# EAGLE design wordclock-2-charlieplex (EAGLE 5.12)
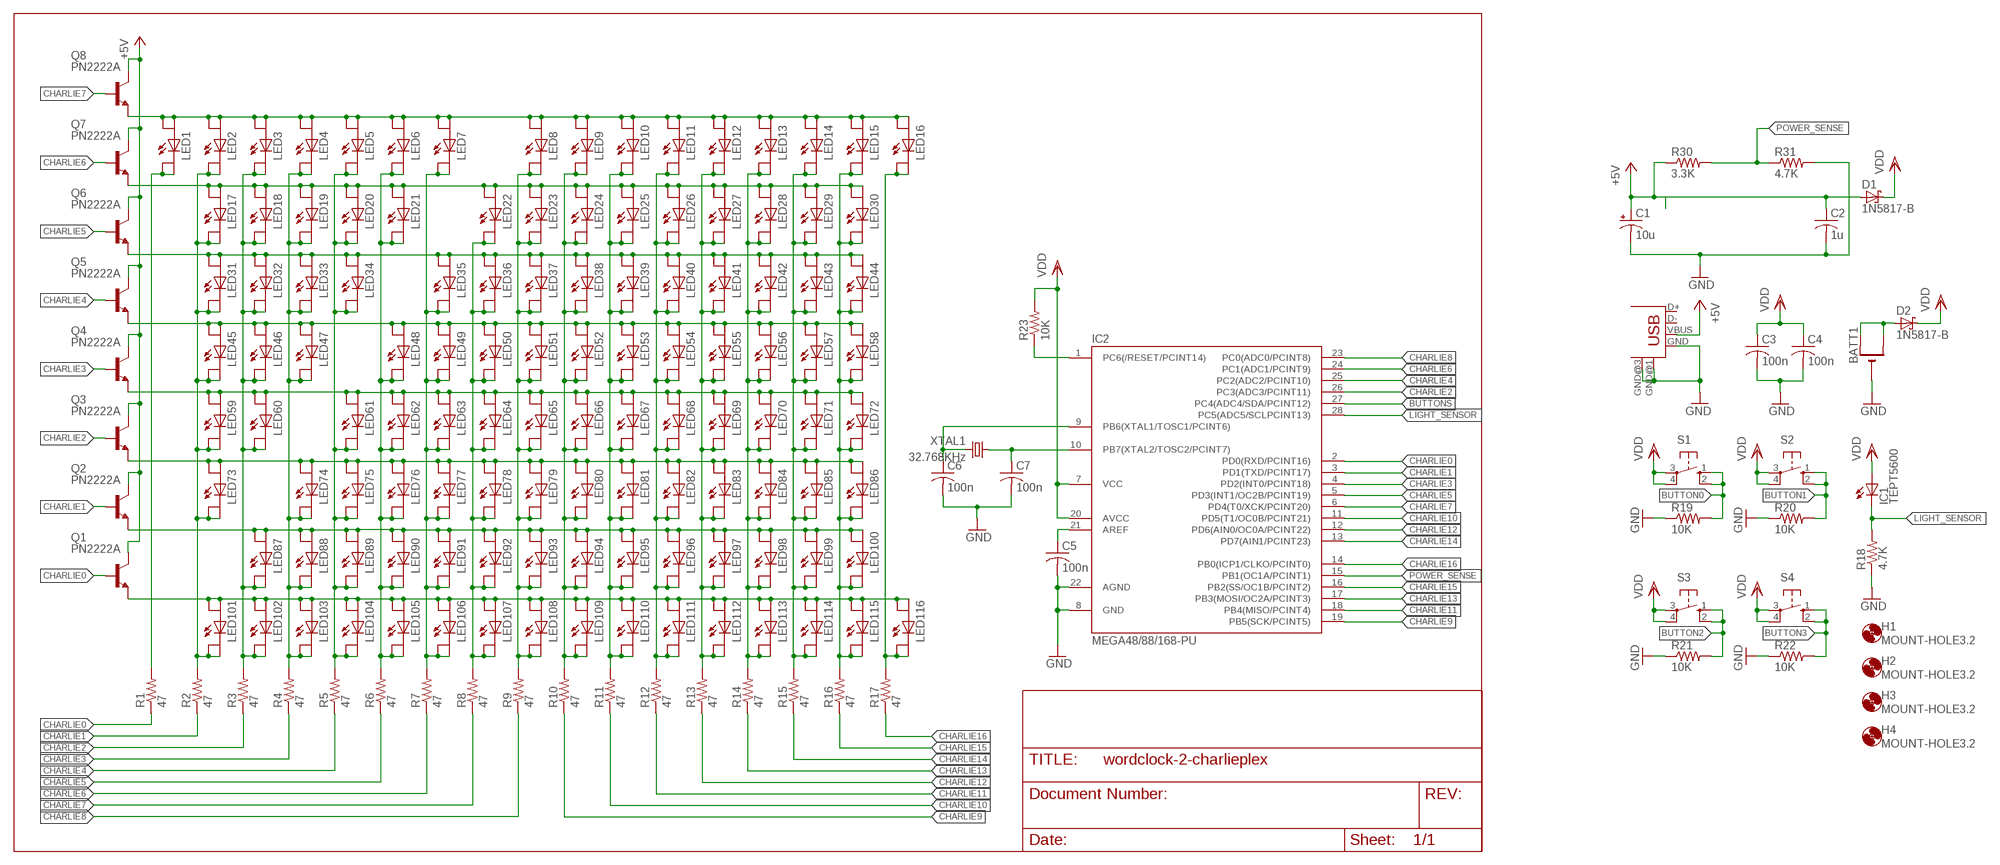
[diagram p0: schematic, sheet 1]

## Parts
BATT1  CR1220THM  [CR1220-THM]
C1  10u  CPOL-USE2-5  [E2-5]
C2  1u  C-US050-025X075  [C050-025X075]
C3  100n  C-US050-025X075  [C050-025X075]
C4  100n  C-US050-025X075  [C050-025X075]
C5  100n  C-US050-025X075  [C050-025X075]
C6  100n  C-US050-025X075  [C050-025X075]
C7  100n  C-US050-025X075  [C050-025X075]
D1  1N5817-B  [DO41-7.6]
D2  1N5817-B  [DO41-7.6]
H1  MOUNT-HOLE3.2  [3,2]
H2  MOUNT-HOLE3.2  [3,2]
H3  MOUNT-HOLE3.2  [3,2]
H4  MOUNT-HOLE3.2  [3,2]
IC1  TEPT5600  LED5MM  [LED5MM]
IC2  MEGA48/88/168-PU  [DIL28-3]
LED1  LED-2PLCC2-T1.75  [PLCC2-T1.75]
LED2  LED-2PLCC2-T1.75  [PLCC2-T1.75]
LED3  LED-2PLCC2-T1.75  [PLCC2-T1.75]
LED4  LED-2PLCC2-T1.75  [PLCC2-T1.75]
LED5  LED-2PLCC2-T1.75  [PLCC2-T1.75]
LED6  LED-2PLCC2-T1.75  [PLCC2-T1.75]
LED7  LED-2PLCC2-T1.75  [PLCC2-T1.75]
LED8  LED-2PLCC2-T1.75  [PLCC2-T1.75]
LED9  LED-2PLCC2-T1.75  [PLCC2-T1.75]
LED10  LED-2PLCC2-T1.75  [PLCC2-T1.75]
LED11  LED-2PLCC2-T1.75  [PLCC2-T1.75]
LED12  LED-2PLCC2-T1.75  [PLCC2-T1.75]
LED13  LED-2PLCC2-T1.75  [PLCC2-T1.75]
LED14  LED-2PLCC2-T1.75  [PLCC2-T1.75]
LED15  LED-2PLCC2-T1.75  [PLCC2-T1.75]
LED16  LED-2PLCC2-T1.75  [PLCC2-T1.75]
LED17  LED-2PLCC2-T1.75  [PLCC2-T1.75]
LED18  LED-2PLCC2-T1.75  [PLCC2-T1.75]
LED19  LED-2PLCC2-T1.75  [PLCC2-T1.75]
LED20  LED-2PLCC2-T1.75  [PLCC2-T1.75]
LED21  LED-2PLCC2-T1.75  [PLCC2-T1.75]
LED22  LED-2PLCC2-T1.75  [PLCC2-T1.75]
LED23  LED-2PLCC2-T1.75  [PLCC2-T1.75]
LED24  LED-2PLCC2-T1.75  [PLCC2-T1.75]
LED25  LED-2PLCC2-T1.75  [PLCC2-T1.75]
LED26  LED-2PLCC2-T1.75  [PLCC2-T1.75]
LED27  LED-2PLCC2-T1.75  [PLCC2-T1.75]
LED28  LED-2PLCC2-T1.75  [PLCC2-T1.75]
LED29  LED-2PLCC2-T1.75  [PLCC2-T1.75]
LED30  LED-2PLCC2-T1.75  [PLCC2-T1.75]
LED31  LED-2PLCC2-T1.75  [PLCC2-T1.75]
LED32  LED-2PLCC2-T1.75  [PLCC2-T1.75]
LED33  LED-2PLCC2-T1.75  [PLCC2-T1.75]
LED34  LED-2PLCC2-T1.75  [PLCC2-T1.75]
LED35  LED-2PLCC2-T1.75  [PLCC2-T1.75]
LED36  LED-2PLCC2-T1.75  [PLCC2-T1.75]
LED37  LED-2PLCC2-T1.75  [PLCC2-T1.75]
LED38  LED-2PLCC2-T1.75  [PLCC2-T1.75]
LED39  LED-2PLCC2-T1.75  [PLCC2-T1.75]
LED40  LED-2PLCC2-T1.75  [PLCC2-T1.75]
LED41  LED-2PLCC2-T1.75  [PLCC2-T1.75]
LED42  LED-2PLCC2-T1.75  [PLCC2-T1.75]
LED43  LED-2PLCC2-T1.75  [PLCC2-T1.75]
LED44  LED-2PLCC2-T1.75  [PLCC2-T1.75]
LED45  LED-2PLCC2-T1.75  [PLCC2-T1.75]
LED46  LED-2PLCC2-T1.75  [PLCC2-T1.75]
LED47  LED-2PLCC2-T1.75  [PLCC2-T1.75]
LED48  LED-2PLCC2-T1.75  [PLCC2-T1.75]
LED49  LED-2PLCC2-T1.75  [PLCC2-T1.75]
LED50  LED-2PLCC2-T1.75  [PLCC2-T1.75]
LED51  LED-2PLCC2-T1.75  [PLCC2-T1.75]
LED52  LED-2PLCC2-T1.75  [PLCC2-T1.75]
LED53  LED-2PLCC2-T1.75  [PLCC2-T1.75]
LED54  LED-2PLCC2-T1.75  [PLCC2-T1.75]
LED55  LED-2PLCC2-T1.75  [PLCC2-T1.75]
LED56  LED-2PLCC2-T1.75  [PLCC2-T1.75]
LED57  LED-2PLCC2-T1.75  [PLCC2-T1.75]
LED58  LED-2PLCC2-T1.75  [PLCC2-T1.75]
LED59  LED-2PLCC2-T1.75  [PLCC2-T1.75]
LED60  LED-2PLCC2-T1.75  [PLCC2-T1.75]
LED61  LED-2PLCC2-T1.75  [PLCC2-T1.75]
LED62  LED-2PLCC2-T1.75  [PLCC2-T1.75]
LED63  LED-2PLCC2-T1.75  [PLCC2-T1.75]
LED64  LED-2PLCC2-T1.75  [PLCC2-T1.75]
LED65  LED-2PLCC2-T1.75  [PLCC2-T1.75]
LED66  LED-2PLCC2-T1.75  [PLCC2-T1.75]
LED67  LED-2PLCC2-T1.75  [PLCC2-T1.75]
LED68  LED-2PLCC2-T1.75  [PLCC2-T1.75]
LED69  LED-2PLCC2-T1.75  [PLCC2-T1.75]
LED70  LED-2PLCC2-T1.75  [PLCC2-T1.75]
LED71  LED-2PLCC2-T1.75  [PLCC2-T1.75]
LED72  LED-2PLCC2-T1.75  [PLCC2-T1.75]
LED73  LED-2PLCC2-T1.75  [PLCC2-T1.75]
LED74  LED-2PLCC2-T1.75  [PLCC2-T1.75]
LED75  LED-2PLCC2-T1.75  [PLCC2-T1.75]
LED76  LED-2PLCC2-T1.75  [PLCC2-T1.75]
LED77  LED-2PLCC2-T1.75  [PLCC2-T1.75]
LED78  LED-2PLCC2-T1.75  [PLCC2-T1.75]
LED79  LED-2PLCC2-T1.75  [PLCC2-T1.75]
LED80  LED-2PLCC2-T1.75  [PLCC2-T1.75]
LED81  LED-2PLCC2-T1.75  [PLCC2-T1.75]
LED82  LED-2PLCC2-T1.75  [PLCC2-T1.75]
LED83  LED-2PLCC2-T1.75  [PLCC2-T1.75]
LED84  LED-2PLCC2-T1.75  [PLCC2-T1.75]
LED85  LED-2PLCC2-T1.75  [PLCC2-T1.75]
LED86  LED-2PLCC2-T1.75  [PLCC2-T1.75]
LED87  LED-2PLCC2-T1.75  [PLCC2-T1.75]
LED88  LED-2PLCC2-T1.75  [PLCC2-T1.75]
LED89  LED-2PLCC2-T1.75  [PLCC2-T1.75]
LED90  LED-2PLCC2-T1.75  [PLCC2-T1.75]
LED91  LED-2PLCC2-T1.75  [PLCC2-T1.75]
LED92  LED-2PLCC2-T1.75  [PLCC2-T1.75]
LED93  LED-2PLCC2-T1.75  [PLCC2-T1.75]
LED94  LED-2PLCC2-T1.75  [PLCC2-T1.75]
LED95  LED-2PLCC2-T1.75  [PLCC2-T1.75]
LED96  LED-2PLCC2-T1.75  [PLCC2-T1.75]
LED97  LED-2PLCC2-T1.75  [PLCC2-T1.75]
LED98  LED-2PLCC2-T1.75  [PLCC2-T1.75]
LED99  LED-2PLCC2-T1.75  [PLCC2-T1.75]
LED100  LED-2PLCC2-T1.75  [PLCC2-T1.75]
LED101  LED-2PLCC2-T1.75  [PLCC2-T1.75]
LED102  LED-2PLCC2-T1.75  [PLCC2-T1.75]
LED103  LED-2PLCC2-T1.75  [PLCC2-T1.75]
LED104  LED-2PLCC2-T1.75  [PLCC2-T1.75]
LED105  LED-2PLCC2-T1.75  [PLCC2-T1.75]
LED106  LED-2PLCC2-T1.75  [PLCC2-T1.75]
LED107  LED-2PLCC2-T1.75  [PLCC2-T1.75]
LED108  LED-2PLCC2-T1.75  [PLCC2-T1.75]
LED109  LED-2PLCC2-T1.75  [PLCC2-T1.75]
LED110  LED-2PLCC2-T1.75  [PLCC2-T1.75]
LED111  LED-2PLCC2-T1.75  [PLCC2-T1.75]
LED112  LED-2PLCC2-T1.75  [PLCC2-T1.75]
LED113  LED-2PLCC2-T1.75  [PLCC2-T1.75]
LED114  LED-2PLCC2-T1.75  [PLCC2-T1.75]
LED115  LED-2PLCC2-T1.75  [PLCC2-T1.75]
LED116  LED-2PLCC2-T1.75  [PLCC2-T1.75]
Q1  PN2222A  2N3904  [TO92]
Q2  PN2222A  2N3904  [TO92]
Q3  PN2222A  2N3904  [TO92]
Q4  PN2222A  2N3904  [TO92]
Q5  PN2222A  2N3904  [TO92]
Q6  PN2222A  2N3904  [TO92]
Q7  PN2222A  2N3904  [TO92]
Q8  PN2222A  2N3904  [TO92]
R1  47  R-US_0207/10  [0207/10]
R2  47  R-US_0207/10  [0207/10]
R3  47  R-US_0207/10  [0207/10]
R4  47  R-US_0207/10  [0207/10]
R5  47  R-US_0207/10  [0207/10]
R6  47  R-US_0207/10  [0207/10]
R7  47  R-US_0207/10  [0207/10]
R8  47  R-US_0207/10  [0207/10]
R9  47  R-US_0207/10  [0207/10]
R10  47  R-US_0207/10  [0207/10]
R11  47  R-US_0207/10  [0207/10]
R12  47  R-US_0207/10  [0207/10]
R13  47  R-US_0207/10  [0207/10]
R14  47  R-US_0207/10  [0207/10]
R15  47  R-US_0207/10  [0207/10]
R16  47  R-US_0207/10  [0207/10]
R17  47  R-US_0207/10  [0207/10]
R18  4.7K  R-US_0207/10  [0207/10]
R19  10K  R-US_0207/10  [0207/10]
R20  10K  R-US_0207/10  [0207/10]
R21  10K  R-US_0207/10  [0207/10]
R22  10K  R-US_0207/10  [0207/10]
R23  10K  R-US_0207/10  [0207/10]
R30  3.3K  R-US_0207/10  [0207/10]
R31  4.7K  R-US_0207/10  [0207/10]
S1  10-XX  [B3F-10XX]
S2  10-XX  [B3F-10XX]
S3  10-XX  [B3F-10XX]
S4  10-XX  [B3F-10XX]
USB1  USB-RAYMOND-SHORT  [USB-MB-RAYMOND-SHORT]
XTAL1  32.768KHz  CRYSTALTC38H  [TC38H]

## Nets
+5V: C1.+ Q1.1(C) Q2.1(C) Q3.1(C) Q4.1(C) Q5.1(C) Q6.1(C) Q7.1(C) Q8.1(C) R30.1 USB1.VBUS
BUTTON0: R19.2 S1.1(S) S1.2(S1)
BUTTON1: R20.2 S2.1(S) S2.2(S1)
BUTTON2: R21.2 S3.1(S) S3.2(S1)
BUTTON3: R22.2 S4.1(S) S4.2(S1)
BUTTONS: IC2.27(PC4(ADC4/SDA/PCINT12))
CHARLIE0: IC2.2(PD0(RXD/PCINT16)) Q1.2(B) R1.1
CHARLIE1: IC2.3(PD1(TXD/PCINT17)) Q2.2(B) R2.1
CHARLIE2: IC2.26(PC3(ADC3/PCINT11)) Q3.2(B) R3.1
CHARLIE3: IC2.4(PD2(INT0/PCINT18)) Q4.2(B) R4.1
CHARLIE4: IC2.25(PC2(ADC2/PCINT10)) Q5.2(B) R5.1
CHARLIE5: IC2.5(PD3(INT1/OC2B/PCINT19)) Q6.2(B) R6.1
CHARLIE6: IC2.24(PC1(ADC1/PCINT9)) Q7.2(B) R7.1
CHARLIE7: IC2.6(PD4(T0/XCK/PCINT20)) Q8.2(B) R8.1
CHARLIE8: IC2.23(PC0(ADC0/PCINT8)) R9.1
CHARLIE9: IC2.19(PB5(SCK/PCINT5)) R10.1
CHARLIE10: IC2.11(PD5(T1/OC0B/PCINT21)) R11.1
CHARLIE11: IC2.18(PB4(MISO/PCINT4)) R12.1
CHARLIE12: IC2.12(PD6(AIN0/OC0A/PCINT22)) R13.1
CHARLIE13: IC2.17(PB3(MOSI/OC2A/PCINT3)) R14.1
CHARLIE14: IC2.13(PD7(AIN1/PCINT23)) R15.1
CHARLIE15: IC2.16(PB2(SS/OC1B/PCINT2)) R16.1
CHARLIE16: IC2.14(PB0(ICP1/CLKO/PCINT0)) R17.1
COL0: LED1.K1(K) LED1.K2(K1) R1.2
COL1: LED2.K1(K) LED2.K2(K1) LED17.K1(K) LED17.K2(K1) LED31.K1(K) LED31.K2(K1) LED45.K1(K) LED45.K2(K1) LED59.K1(K) LED59.K2(K1) LED73.K1(K) LED73.K2(K1) LED101.K1(K) LED101.K2(K1) R2.2
COL2: LED3.K1(K) LED3.K2(K1) LED18.K1(K) LED18.K2(K1) LED32.K1(K) LED32.K2(K1) LED46.K1(K) LED46.K2(K1) LED60.K1(K) LED60.K2(K1) LED87.K1(K) LED87.K2(K1) LED102.K1(K) LED102.K2(K1) R3.2
COL3: LED4.K1(K) LED4.K2(K1) LED19.K1(K) LED19.K2(K1) LED33.K1(K) LED33.K2(K1) LED47.K1(K) LED47.K2(K1) LED74.K1(K) LED74.K2(K1) LED88.K1(K) LED88.K2(K1) LED103.K1(K) LED103.K2(K1) R4.2
COL4: LED5.K1(K) LED5.K2(K1) LED20.K1(K) LED20.K2(K1) LED34.K1(K) LED34.K2(K1) LED61.K1(K) LED61.K2(K1) LED75.K1(K) LED75.K2(K1) LED89.K1(K) LED89.K2(K1) LED104.K1(K) LED104.K2(K1) R5.2
COL5: LED6.K1(K) LED6.K2(K1) LED21.K1(K) LED21.K2(K1) LED48.K1(K) LED48.K2(K1) LED62.K1(K) LED62.K2(K1) LED76.K1(K) LED76.K2(K1) LED90.K1(K) LED90.K2(K1) LED105.K1(K) LED105.K2(K1) R6.2
COL6: LED7.K1(K) LED7.K2(K1) LED35.K1(K) LED35.K2(K1) LED49.K1(K) LED49.K2(K1) LED63.K1(K) LED63.K2(K1) LED77.K1(K) LED77.K2(K1) LED91.K1(K) LED91.K2(K1) LED106.K1(K) LED106.K2(K1) R7.2
COL7: LED22.K1(K) LED22.K2(K1) LED36.K1(K) LED36.K2(K1) LED50.K1(K) LED50.K2(K1) LED64.K1(K) LED64.K2(K1) LED78.K1(K) LED78.K2(K1) LED92.K1(K) LED92.K2(K1) LED107.K1(K) LED107.K2(K1) R8.2
COL8: LED8.K1(K) LED8.K2(K1) LED23.K1(K) LED23.K2(K1) LED37.K1(K) LED37.K2(K1) LED51.K1(K) LED51.K2(K1) LED65.K1(K) LED65.K2(K1) LED79.K1(K) LED79.K2(K1) LED93.K1(K) LED93.K2(K1) LED108.K1(K) LED108.K2(K1) R9.2
COL9: LED9.K1(K) LED9.K2(K1) LED24.K1(K) LED24.K2(K1) LED38.K1(K) LED38.K2(K1) LED52.K1(K) LED52.K2(K1) LED66.K1(K) LED66.K2(K1) LED80.K1(K) LED80.K2(K1) LED94.K1(K) LED94.K2(K1) LED109.K1(K) LED109.K2(K1) R10.2
COL10: LED10.K1(K) LED10.K2(K1) LED25.K1(K) LED25.K2(K1) LED39.K1(K) LED39.K2(K1) LED53.K1(K) LED53.K2(K1) LED67.K1(K) LED67.K2(K1) LED81.K1(K) LED81.K2(K1) LED95.K1(K) LED95.K2(K1) LED110.K1(K) LED110.K2(K1) R11.2
COL11: LED11.K1(K) LED11.K2(K1) LED26.K1(K) LED26.K2(K1) LED40.K1(K) LED40.K2(K1) LED54.K1(K) LED54.K2(K1) LED68.K1(K) LED68.K2(K1) LED82.K1(K) LED82.K2(K1) LED96.K1(K) LED96.K2(K1) LED111.K1(K) LED111.K2(K1) R12.2
COL12: LED12.K1(K) LED12.K2(K1) LED27.K1(K) LED27.K2(K1) LED41.K1(K) LED41.K2(K1) LED55.K1(K) LED55.K2(K1) LED69.K1(K) LED69.K2(K1) LED83.K1(K) LED83.K2(K1) LED97.K1(K) LED97.K2(K1) LED112.K1(K) LED112.K2(K1) R13.2
COL13: LED13.K1(K) LED13.K2(K1) LED28.K1(K) LED28.K2(K1) LED42.K1(K) LED42.K2(K1) LED56.K1(K) LED56.K2(K1) LED70.K1(K) LED70.K2(K1) LED84.K1(K) LED84.K2(K1) LED98.K1(K) LED98.K2(K1) LED113.K1(K) LED113.K2(K1) R14.2
COL14: LED14.K1(K) LED14.K2(K1) LED29.K1(K) LED29.K2(K1) LED43.K1(K) LED43.K2(K1) LED57.K1(K) LED57.K2(K1) LED71.K1(K) LED71.K2(K1) LED85.K1(K) LED85.K2(K1) LED99.K1(K) LED99.K2(K1) LED114.K1(K) LED114.K2(K1) R15.2
COL15: LED15.K1(K) LED15.K2(K1) LED30.K1(K) LED30.K2(K1) LED44.K1(K) LED44.K2(K1) LED58.K1(K) LED58.K2(K1) LED72.K1(K) LED72.K2(K1) LED86.K1(K) LED86.K2(K1) LED100.K1(K) LED100.K2(K1) LED115.K1(K) LED115.K2(K1) R16.2
COL16: LED16.K1(K) LED16.K2(K1) LED116.K1(K) LED116.K2(K1) R17.2
GND: BATT1.- C1.- C2.2 C3.2 C4.2 C5.2 C6.2 C7.2 IC2.8(GND) IC2.22(AGND) R18.1 R19.1 R20.1 R21.1 R22.1 R31.2 USB1.GND USB1.GND@1(GND) USB1.GND@3(GND)
LIGHT_SENSOR: IC1.K(C) IC2.28(PC5(ADC5/SCLPCINT13)) R18.2
N$1: C5.1 IC2.21(AREF)
N$2: C6.1 IC2.9(PB6(XTAL1/TOSC1/PCINT6)) XTAL1.2
N$3: BATT1.+1(+) BATT1.+2(+1) D2.A
N$4: IC2.1(PC6(/RESET/PCINT14)) R23.1
N$5: C7.1 IC2.10(PB7(XTAL2/TOSC2/PCINT7)) XTAL1.1
N$9: C2.1 D1.A
POWER_SENSE: IC2.15(PB1(OC1A/PCINT1)) R30.2 R31.1
ROW0: LED101.A1(A) LED101.A2(A1) LED102.A1(A) LED102.A2(A1) LED103.A1(A) LED103.A2(A1) LED104.A1(A) LED104.A2(A1) LED105.A1(A) LED105.A2(A1) LED106.A1(A) LED106.A2(A1) LED107.A1(A) LED107.A2(A1) LED108.A1(A) LED108.A2(A1) LED109.A1(A) LED109.A2(A1) LED110.A1(A) LED110.A2(A1) LED111.A1(A) LED111.A2(A1) LED112.A1(A) LED112.A2(A1) LED113.A1(A) LED113.A2(A1) LED114.A1(A) LED114.A2(A1) LED115.A1(A) LED115.A2(A1) LED116.A1(A) LED116.A2(A1) Q1.3(E)
ROW1: LED87.A1(A) LED87.A2(A1) LED88.A1(A) LED88.A2(A1) LED89.A1(A) LED89.A2(A1) LED90.A1(A) LED90.A2(A1) LED91.A1(A) LED91.A2(A1) LED92.A1(A) LED92.A2(A1) LED93.A1(A) LED93.A2(A1) LED94.A1(A) LED94.A2(A1) LED95.A1(A) LED95.A2(A1) LED96.A1(A) LED96.A2(A1) LED97.A1(A) LED97.A2(A1) LED98.A1(A) LED98.A2(A1) LED99.A1(A) LED99.A2(A1) LED100.A1(A) LED100.A2(A1) Q2.3(E)
ROW2: LED73.A1(A) LED73.A2(A1) LED74.A1(A) LED74.A2(A1) LED75.A1(A) LED75.A2(A1) LED76.A1(A) LED76.A2(A1) LED77.A1(A) LED77.A2(A1) LED78.A1(A) LED78.A2(A1) LED79.A1(A) LED79.A2(A1) LED80.A1(A) LED80.A2(A1) LED81.A1(A) LED81.A2(A1) LED82.A1(A) LED82.A2(A1) LED83.A1(A) LED83.A2(A1) LED84.A1(A) LED84.A2(A1) LED85.A1(A) LED85.A2(A1) LED86.A1(A) LED86.A2(A1) Q3.3(E)
ROW3: LED59.A1(A) LED59.A2(A1) LED60.A1(A) LED60.A2(A1) LED61.A1(A) LED61.A2(A1) LED62.A1(A) LED62.A2(A1) LED63.A1(A) LED63.A2(A1) LED64.A1(A) LED64.A2(A1) LED65.A1(A) LED65.A2(A1) LED66.A1(A) LED66.A2(A1) LED67.A1(A) LED67.A2(A1) LED68.A1(A) LED68.A2(A1) LED69.A1(A) LED69.A2(A1) LED70.A1(A) LED70.A2(A1) LED71.A1(A) LED71.A2(A1) LED72.A1(A) LED72.A2(A1) Q4.3(E)
ROW4: LED45.A1(A) LED45.A2(A1) LED46.A1(A) LED46.A2(A1) LED47.A1(A) LED47.A2(A1) LED48.A1(A) LED48.A2(A1) LED49.A1(A) LED49.A2(A1) LED50.A1(A) LED50.A2(A1) LED51.A1(A) LED51.A2(A1) LED52.A1(A) LED52.A2(A1) LED53.A1(A) LED53.A2(A1) LED54.A1(A) LED54.A2(A1) LED55.A1(A) LED55.A2(A1) LED56.A1(A) LED56.A2(A1) LED57.A1(A) LED57.A2(A1) LED58.A1(A) LED58.A2(A1) Q5.3(E)
ROW5: LED31.A1(A) LED31.A2(A1) LED32.A1(A) LED32.A2(A1) LED33.A1(A) LED33.A2(A1) LED34.A1(A) LED34.A2(A1) LED35.A1(A) LED35.A2(A1) LED36.A1(A) LED36.A2(A1) LED37.A1(A) LED37.A2(A1) LED38.A1(A) LED38.A2(A1) LED39.A1(A) LED39.A2(A1) LED40.A1(A) LED40.A2(A1) LED41.A1(A) LED41.A2(A1) LED42.A1(A) LED42.A2(A1) LED43.A1(A) LED43.A2(A1) LED44.A1(A) LED44.A2(A1) Q6.3(E)
ROW6: LED17.A1(A) LED17.A2(A1) LED18.A1(A) LED18.A2(A1) LED19.A1(A) LED19.A2(A1) LED20.A1(A) LED20.A2(A1) LED21.A1(A) LED21.A2(A1) LED22.A1(A) LED22.A2(A1) LED23.A1(A) LED23.A2(A1) LED24.A1(A) LED24.A2(A1) LED25.A1(A) LED25.A2(A1) LED26.A1(A) LED26.A2(A1) LED27.A1(A) LED27.A2(A1) LED28.A1(A) LED28.A2(A1) LED29.A1(A) LED29.A2(A1) LED30.A1(A) LED30.A2(A1) Q7.3(E)
ROW7: LED1.A1(A) LED1.A2(A1) LED2.A1(A) LED2.A2(A1) LED3.A1(A) LED3.A2(A1) LED4.A1(A) LED4.A2(A1) LED5.A1(A) LED5.A2(A1) LED6.A1(A) LED6.A2(A1) LED7.A1(A) LED7.A2(A1) LED8.A1(A) LED8.A2(A1) LED9.A1(A) LED9.A2(A1) LED10.A1(A) LED10.A2(A1) LED11.A1(A) LED11.A2(A1) LED12.A1(A) LED12.A2(A1) LED13.A1(A) LED13.A2(A1) LED14.A1(A) LED14.A2(A1) LED15.A1(A) LED15.A2(A1) LED16.A1(A) LED16.A2(A1) Q8.3(E)
VDD: C3.1 C4.1 D1.C D2.C IC1.A IC2.7(VCC) IC2.20(AVCC) R23.2 S1.3(P) S1.4(P1) S2.3(P) S2.4(P1) S3.3(P) S3.4(P1) S4.3(P) S4.4(P1)
Unconnected: USB1.D+ USB1.D-

## Library data of the parts
BATT1 = adafruit:CR1220: CR1216/CR1220/CR1225 12mm 3V lithium coin cell Great for battery packup. Both SMT and THM holders. Note the THM package has the ground pads on both sides of the PCB so that the masks are the same - this reduces the cost
C1 = rcl:CPOL-US: POLARIZED CAPACITOR, American symbol
C2-C7 = rcl:C-US: CAPACITOR, American symbol
D1 D2 = diode:1N581*: 1.0A SCHOTTKY BARRIER RECTIFIER Source: http://www.diodes.com/datasheets/ds23001.pdf
H1-H4 = holes:MOUNT-HOLE: MOUNTING HOLE with drill center marker
IC1 = led:LED: LED OSRAM: - CHIPLED LG R971, LG N971, LY N971, LG Q971, LY Q971, LO R971, LY R971 LH N974, LH R974 LS Q976, LO Q976, LY Q976 LO Q996 - Hyper CHIPLED LW Q18S LB Q993, LB Q99A, LB R99A - SideLED LS A670, LO A670, LY A670, LG A670, LP A670 LB A673, LV A673, LT A673, LW A673 LH A674 LY A675 LS A676, LA A676, LO A676, LY A676, LW A676 LS A679, LY A679, LG A679 - Hyper Micro SIDELED® LS Y876, LA Y876, LO Y876, LY Y876 LT Y87S - SmartLED LW L88C, LW L88S LB L89C, LB L89S, LG L890 LS L89K, LO L89K, LY L89K LS L896, LA L896, LO L896, LY L896 - TOPLED LS T670, LO T670, LY T670, LG T670, LP T670 LSG T670, LSP T670, LSY T670, LOP T670, LYG T670 LG T671, LOG T671, LSG T671 LB T673, LV T673, LT T673, LW T673 LH T674 LS T676, LA T676, LO T676, LY T676, LB T676, LH T676, LSB T676, LW T676 LB T67C, LV T67C, LT T67C, LS T67K, LO T67K, LY T67K, LW E67C LS E67B, LA E67B, LO E67B, LY E67B, LB E67C, LV E67C, LT E67C LW T67C LS T679, LY T679, LG T679 LS T770, LO T770, LY T770, LG T770, LP T770 LB T773, LV T773, LT T773, LW T773 LH T774 LS E675, LA E675, LY E675, LS T675 LS T776, LA T776, LO T776, LY T776, LB T776 LHGB T686 LT T68C, LB T68C - Hyper Mini TOPLED® LB M676 - Mini TOPLED Santana® LG M470 LS M47K, LO M47K, LY M47K Source: http://www.osram.convergy.de LUXEON: - LUMILED® LXK2-PW12-R00, LXK2-PW12-S00, LXK2-PW14-U00, LXK2-PW14-V00 LXK2-PM12-R00, LXK2-PM12-S00, LXK2-PM14-U00 LXK2-PE12-Q00, LXK2-PE12-R00, LXK2-PE12-S00, LXK2-PE14-T00, LXK2-PE14-U00 LXK2-PB12-K00, LXK2-PB12-L00, LXK2-PB12-M00, LXK2-PB14-N00, LXK2-PB14-P00, LXK2-PB14-Q00 LXK2-PR12-L00, LXK2-PR12-M00, LXK2-PR14-Q00, LXK2-PR14-R00 LXK2-PD12-Q00, LXK2-PD12-R00, LXK2-PD12-S00 LXK2-PH12-R00, LXK2-PH12-S00 LXK2-PL12-P00, LXK2-PL12-Q00, LXK2-PL12-R00 Source: www.luxeon.com KINGBRIGHT: KA-3528ASYC Source: www.kingbright.com
IC2 = avr-5:MEGA48/88/168-PU
LED1-LED116 = rbg-comboled:LED-2
Q1-Q8 = transistor-npn:2N3904: NPN Transistor
R1-R23 R30 R31 = rcl:R-US_: RESISTOR, American symbol
S1-S4 = switch-omron:10-XX: OMRON SWITCH; MPN: B3F-1000; OC_FARNELL: 176432; OC_NEWARK: 36M3542
USB1 = con-usb-2:USB: USB Connectors
XTAL1 = crystal:CRYSTAL: CRYSTAL; OC_FARNELL: unknown; OC_NEWARK: unknown

## Board
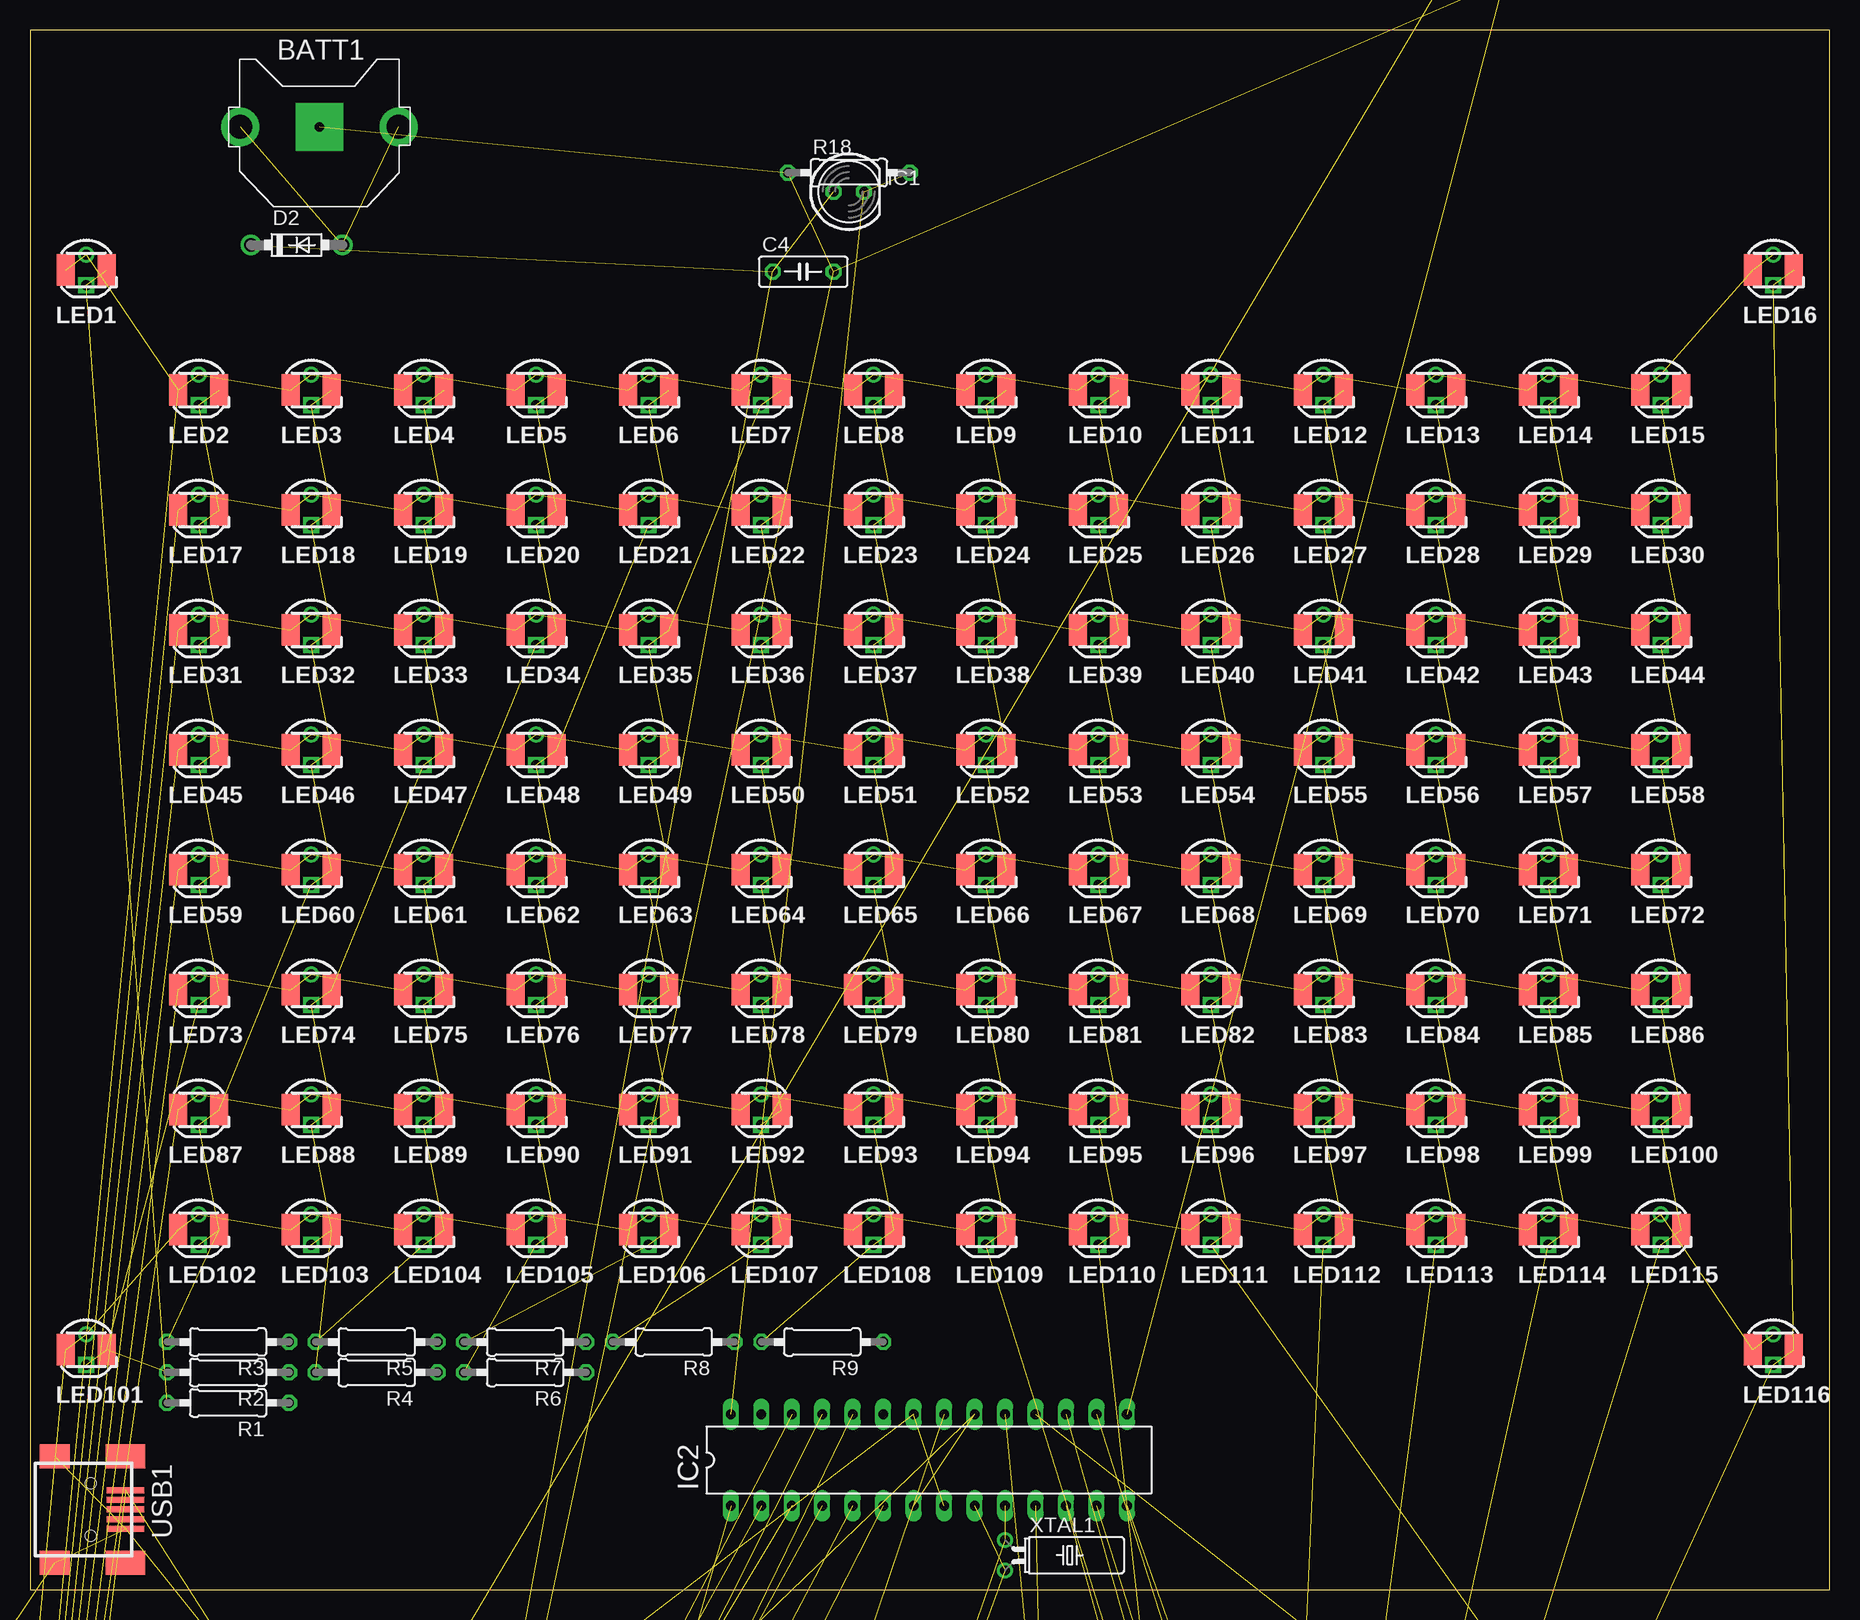
[diagram p1: board, top side]
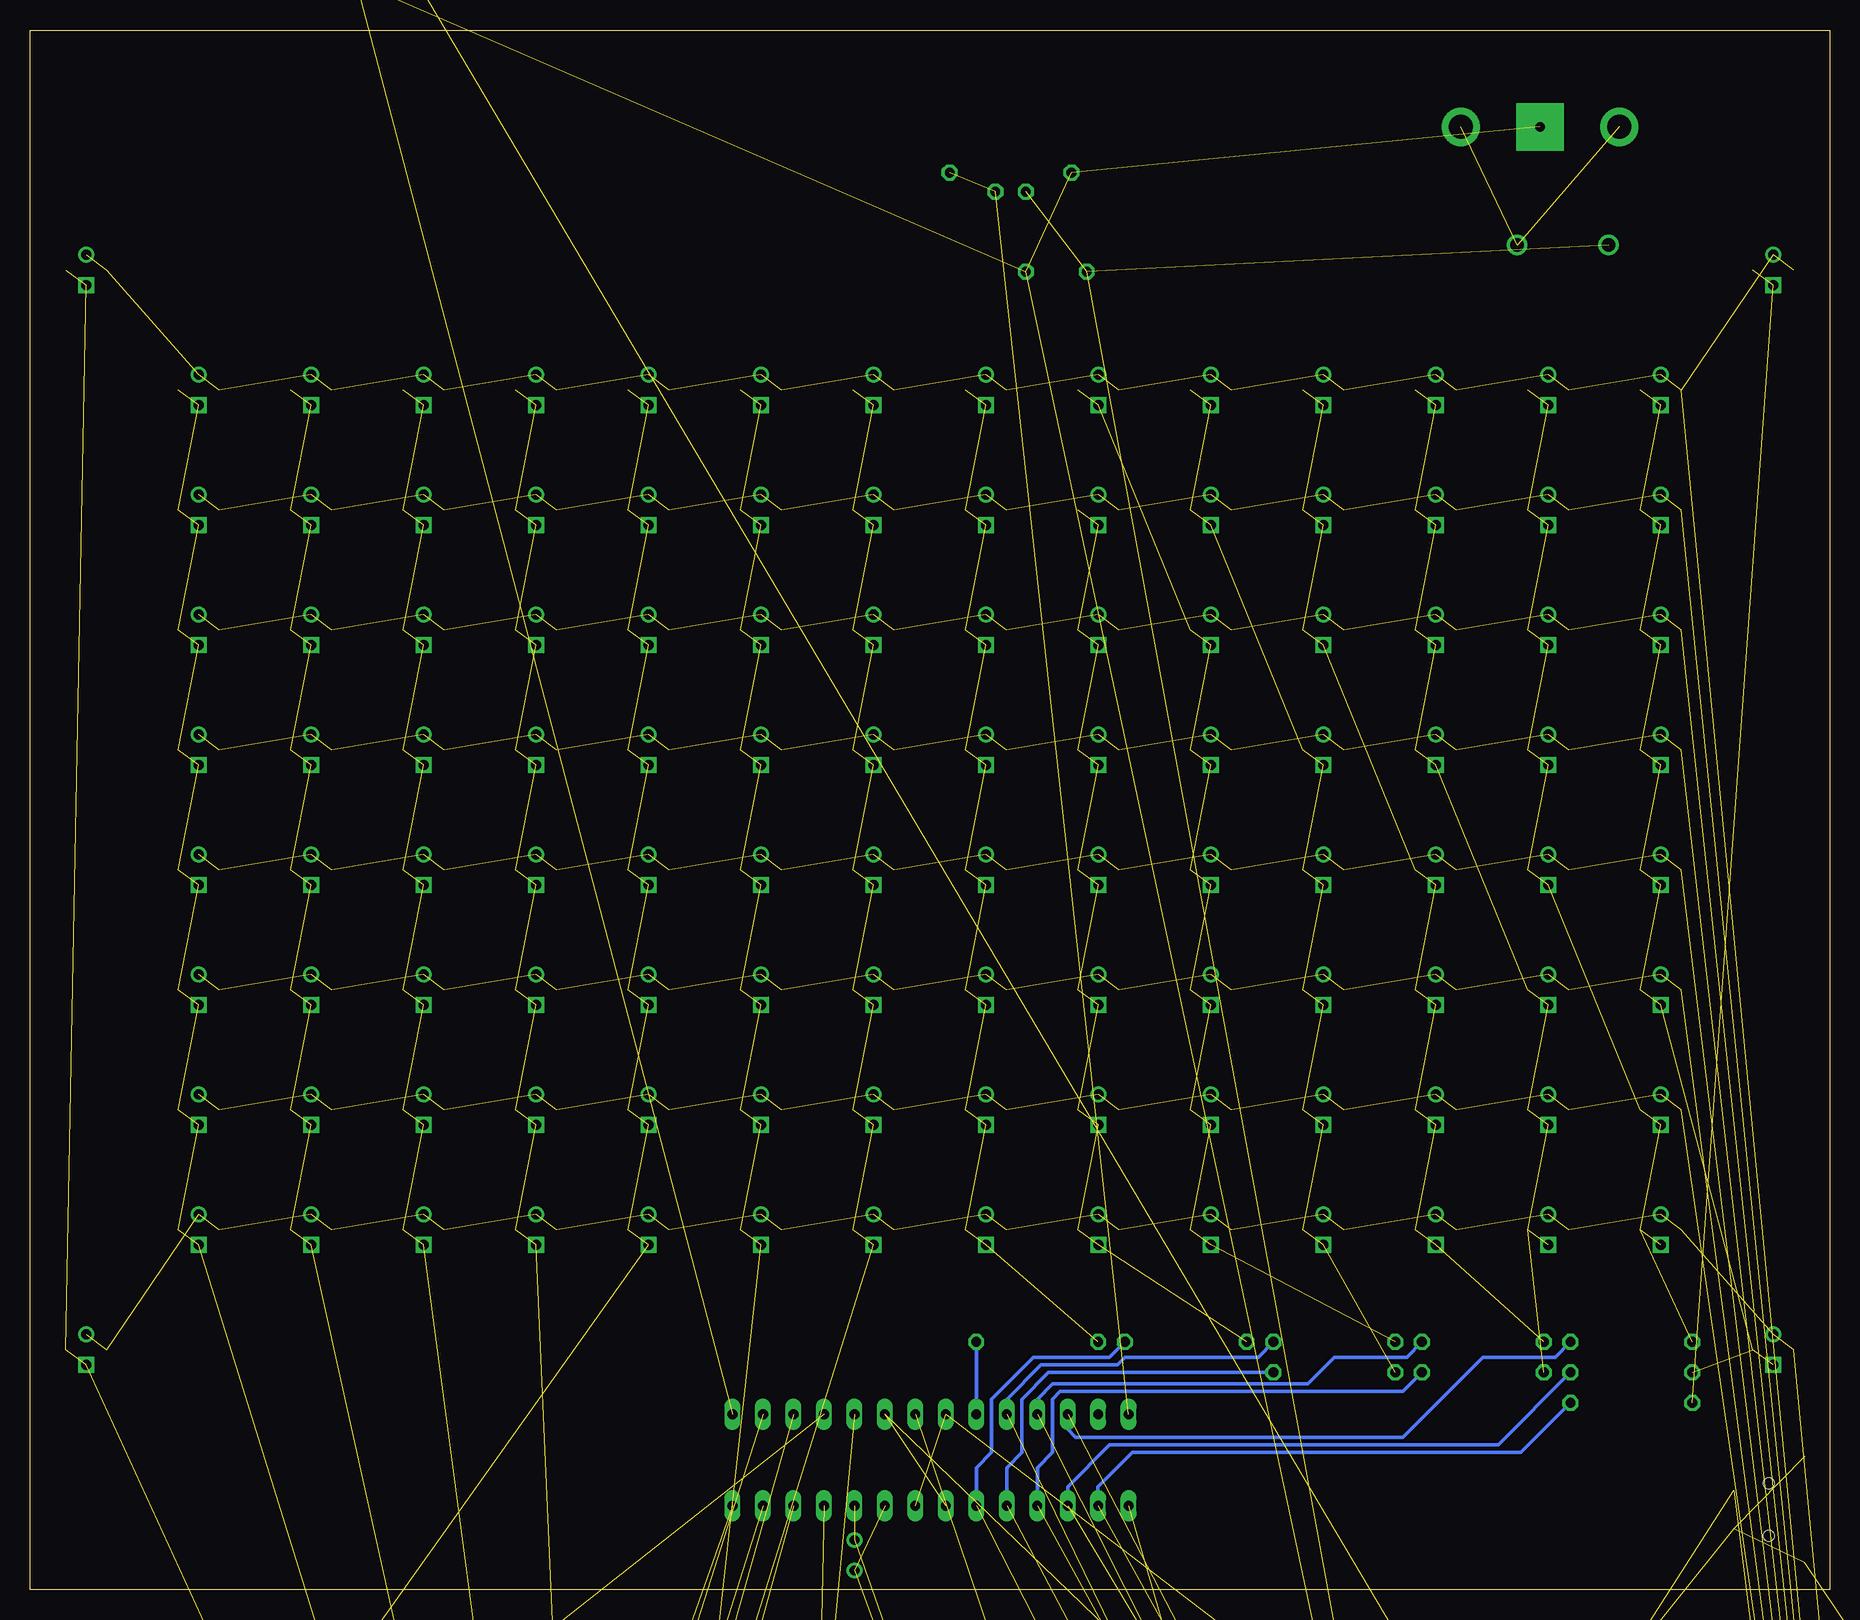
[diagram p2: board, bottom side, seen from below]

Size 150 x 130 mm. Coordinates in mm from the lower left corner, seen from the top.
Outline: 0,0 150,0 150,130 0,130 0,0
Copper layers (1*16): Top 0.035mm / dielectric 1.5mm / Bottom 0.035mm
Design rules "default *": minimum track width 10mil, minimum drill 24mil, track to track 10mil, track to pad 10mil, pad to pad 10mil, via to via 10mil, smd to smd 10mil, copper to edge 40mil, drill to drill 8mil, minimum pad ring 10mil, minimum via ring 8mil, stop-mask expansion 4mil, vias tented up to drill 0mil, thermal gap 10mil

### Footprints (pad centres in the part's own frame; a part is rotated, then mirrored left to right if it is on the bottom)
CR1220-THM = drill 2 pad 3.175 round: +1 -6.604,0; +2 6.604,0 | drill 0.8 pad 3.962 square: - 0,0
E2-5 = drill 0.813 pad 1.27 round: + -1.016,0 | drill 0.813 pad 1.27 octagon: - 1.016,0
C050-025X075 = drill 0.813 octagon: 1 -2.54,0; 2 2.54,0
DO41-7.6 = drill 1.1 pad 1.7 round: A 3.81,0; C -3.81,0
3,2 = hole 3.2: 0,0
LED5MM = drill 0.813 octagon: A -1.27,0; K 1.27,0
DIL28-3 = drill 0.813 long: 1 -16.51,-3.81; 2 -13.97,-3.81; 3 -11.43,-3.81; 4 -8.89,-3.81; 5 -6.35,-3.81; 6 -3.81,-3.81; 7 -1.27,-3.81; 8 1.27,-3.81; 9 3.81,-3.81; 10 6.35,-3.81; 11 8.89,-3.81; 12 11.43,-3.81; 13 13.97,-3.81; 14 16.51,-3.81; 15 16.51,3.81; 16 13.97,3.81; 17 11.43,3.81; 18 8.89,3.81; 19 6.35,3.81; 20 3.81,3.81; 21 1.27,3.81; 22 -1.27,3.81; 23 -3.81,3.81; 24 -6.35,3.81; 25 -8.89,3.81; 26 -11.43,3.81; 27 -13.97,3.81; 28 -16.51,3.81
PLCC2-T1.75 = drill 0.8 round: A1 0,1.27 | smd 1.5 x 2.6: A2 -1.7,0; K2 1.7,0 | drill 0.8 square: K1 0,-1.27
TO92 = drill 0.813 octagon: 1 1.27,0; 2 0,1.905; 3 -1.27,0
0207/10 = drill 0.813 octagon: 1 -5.08,0; 2 5.08,0
B3F-10XX = drill 1.016 long: 1 -3.251,2.261; 2 3.251,2.261; 3 -3.251,-2.261; 4 3.251,-2.261
USB-MB-RAYMOND-SHORT = smd 0.5 x 3.1: D+ 0,4.15; D- -0.8,4.15; GND 1.6,4.15; ID 0.8,4.15; VBUS -1.6,4.15 | smd 2 x 2.5: GND@1 -4.45,-1.75; GND@3 4.45,-1.75 | smd 2 x 3.3: GND@2 -4.45,4.15; GND@4 4.45,4.15 | hole 0.9: -2.2,1.25; 2.2,1.25
TC38H = drill 0.813 round: 1 -1.27,0; 2 1.27,0

### Placement (x,y rotation side)
BATT1  24.13,121.92 0 top
C1  27.3,-20.32 0 top  (outside the outline)
C2  20,-24.45 0 top  (outside the outline)
C3  37.15,-27.94 270 top  (outside the outline)
C4  64.45,109.86 0 top
C5  -16.19,-265.75 0 top  (outside the outline)
C6  -16.19,-273.37 0 top  (outside the outline)
C7  -16.19,-280.99 0 top  (outside the outline)
D1  22.54,-29.21 0 top  (outside the outline)
D2  22.23,112.08 0 top
H1  -7.62,-83.82 0 top  (outside the outline)
H2  -7.62,-92.08 0 top  (outside the outline)
H3  -7.62,-100.33 0 top  (outside the outline)
H4  -7.62,-108.58 0 top  (outside the outline)
IC1  68.26,116.52 0 top
IC2  74.93,10.79 0 top
LED1  4.69,110 0 top
LED2  14.06,100 0 top
LED3  23.44,100 0 top
LED4  32.81,100 0 top
LED5  42.19,100 0 top
LED6  51.56,100 0 top
LED7  60.94,100 0 top
LED8  70.31,100 0 top
LED9  79.69,100 0 top
LED10  89.06,100 0 top
LED11  98.44,100 0 top
LED12  107.81,100 0 top
LED13  117.19,100 0 top
LED14  126.56,100 0 top
LED15  135.94,100 0 top
LED16  145.31,110 0 top
LED17  14.06,90 0 top
LED18  23.44,90 0 top
LED19  32.81,90 0 top
LED20  42.19,90 0 top
LED21  51.56,90 0 top
LED22  60.94,90 0 top
LED23  70.31,90 0 top
LED24  79.69,90 0 top
LED25  89.06,90 0 top
LED26  98.44,90 0 top
LED27  107.81,90 0 top
LED28  117.19,90 0 top
LED29  126.56,90 0 top
LED30  135.94,90 0 top
LED31  14.06,80 0 top
LED32  23.44,80 0 top
LED33  32.81,80 0 top
LED34  42.19,80 0 top
LED35  51.56,80 0 top
LED36  60.94,80 0 top
LED37  70.31,80 0 top
LED38  79.69,80 0 top
LED39  89.06,80 0 top
LED40  98.44,80 0 top
LED41  107.81,80 0 top
LED42  117.19,80 0 top
LED43  126.56,80 0 top
LED44  135.94,80 0 top
LED45  14.06,70 0 top
LED46  23.44,70 0 top
LED47  32.81,70 0 top
LED48  42.19,70 0 top
LED49  51.56,70 0 top
LED50  60.94,70 0 top
LED51  70.31,70 0 top
LED52  79.69,70 0 top
LED53  89.06,70 0 top
LED54  98.44,70 0 top
LED55  107.81,70 0 top
LED56  117.19,70 0 top
LED57  126.56,70 0 top
LED58  135.94,70 0 top
LED59  14.06,60 0 top
LED60  23.44,60 0 top
LED61  32.81,60 0 top
LED62  42.19,60 0 top
LED63  51.56,60 0 top
LED64  60.94,60 0 top
LED65  70.31,60 0 top
LED66  79.69,60 0 top
LED67  89.06,60 0 top
LED68  98.44,60 0 top
LED69  107.81,60 0 top
LED70  117.19,60 0 top
LED71  126.56,60 0 top
LED72  135.94,60 0 top
LED73  14.06,50 0 top
LED74  23.44,50 0 top
LED75  32.81,50 0 top
LED76  42.19,50 0 top
LED77  51.56,50 0 top
LED78  60.94,50 0 top
LED79  70.31,50 0 top
LED80  79.69,50 0 top
LED81  89.06,50 0 top
LED82  98.44,50 0 top
LED83  107.81,50 0 top
LED84  117.19,50 0 top
LED85  126.56,50 0 top
LED86  135.94,50 0 top
LED87  14.06,40 0 top
LED88  23.44,40 0 top
LED89  32.81,40 0 top
LED90  42.19,40 0 top
LED91  51.56,40 0 top
LED92  60.94,40 0 top
LED93  70.31,40 0 top
LED94  79.69,40 0 top
LED95  89.06,40 0 top
LED96  98.44,40 0 top
LED97  107.81,40 0 top
LED98  117.19,40 0 top
LED99  126.56,40 0 top
LED100  135.94,40 0 top
LED101  4.69,20 0 top
LED102  14.06,30 0 top
LED103  23.44,30 0 top
LED104  32.81,30 0 top
LED105  42.19,30 0 top
LED106  51.56,30 0 top
LED107  60.94,30 0 top
LED108  70.31,30 0 top
LED109  79.69,30 0 top
LED110  89.06,30 0 top
LED111  98.44,30 0 top
LED112  107.81,30 0 top
LED113  117.19,30 0 top
LED114  126.56,30 0 top
LED115  135.94,30 0 top
LED116  145.31,20 0 top
Q1  -9.21,-121.6 0 top  (outside the outline)
Q2  -8.89,-115.89 0 top  (outside the outline)
Q3  -9.53,-127.32 0 top  (outside the outline)
Q4  -9.84,-133.03 0 top  (outside the outline)
Q5  -10.16,-138.75 0 top  (outside the outline)
Q6  -10.48,-144.46 0 top  (outside the outline)
Q7  -10.79,-150.18 0 top  (outside the outline)
Q8  -11.11,-155.89 0 top  (outside the outline)
R1  16.51,15.56 180 top
R2  16.51,18.1 180 top
R3  16.51,20.64 180 top
R4  28.89,18.1 180 top
R5  28.89,20.64 180 top
R6  41.27,18.1 180 top
R7  41.27,20.64 180 top
R8  53.66,20.64 180 top
R9  66.04,20.64 180 top
R10  89.53,-19.05 0 top  (outside the outline)
R11  89.53,-21.59 0 top  (outside the outline)
R12  121.92,-11.43 0 top  (outside the outline)
R13  104.46,-53.34 90 top  (outside the outline)
R14  107,-53.34 90 top  (outside the outline)
R15  109.54,-53.34 90 top  (outside the outline)
R16  112.08,-53.34 90 top  (outside the outline)
R17  114.62,-53.34 90 top  (outside the outline)
R18  68.26,118.11 0 top
R19  -5.08,-15.88 0 top  (outside the outline)
R20  -5.08,-31.11 0 top  (outside the outline)
R21  -5.08,-46.35 0 top  (outside the outline)
R22  -5.08,-61.59 0 top  (outside the outline)
R23  -13.65,-260.67 0 top  (outside the outline)
R30  128.59,143.83 0 top  (outside the outline)
R31  129.22,139.06 0 top  (outside the outline)
S1  -5.71,-6.99 0 top  (outside the outline)
S2  -5.71,-23.5 0 top  (outside the outline)
S3  -5.71,-38.73 0 top  (outside the outline)
S4  -5.71,-53.98 0 top  (outside the outline)
USB1  3.81,6.67 270 top
XTAL1  81.28,2.86 270 top

### Tracks (layer width: path | path; a pad name or v marks a point on that pad's centre or on a via)
+5V  (10 unrouted)
BUTTON0  (2 unrouted)
BUTTON1  (2 unrouted)
BUTTON2  (2 unrouted)
BUTTON3  (2 unrouted)
CHARLIE0  (1 unrouted)
  Bottom 0.305: IC2.2 60.96,8.57 58.1,11.43 25.72,11.43 R1.1
CHARLIE1  (1 unrouted)
  Bottom 0.305: IC2.3 63.5,8.57 60.01,12.06 27.62,12.06 R2.1
CHARLIE2  (1 unrouted)
  Bottom 0.305: R3.1 22.86,19.37 28.89,19.37 35.56,12.7 62.87,12.7 63.5,13.34 IC2.26
CHARLIE3  (1 unrouted)
  Bottom 0.305: IC2.4 66.04,10.16 64.77,11.43 64.77,15.88 64.14,16.51 35.56,16.51 R4.1
CHARLIE4  (1 unrouted)
  Bottom 0.305: IC2.25 66.04,15.88 64.77,17.14 43.5,17.14 41.27,19.37 35.24,19.37 R5.1
CHARLIE5  (1 unrouted)
  Bottom 0.305: IC2.5 68.58,10.16 67.31,11.43 67.31,15.88 65.09,18.1 R6.1
CHARLIE6  (1 unrouted)
  Bottom 0.305: R7.1 47.62,19.37 58.74,19.37 59.37,18.73 65.72,18.73 68.58,15.88 IC2.24
CHARLIE7  (1 unrouted)
  Bottom 0.305: R8.1 60.01,19.37 66.36,19.37 69.85,15.88 69.85,11.43 71.12,10.16 IC2.6
CHARLIE8
  Bottom 0.305: IC2.23 R9.1
CHARLIE9  (1 unrouted)
CHARLIE10  (1 unrouted)
CHARLIE11  (1 unrouted)
CHARLIE12  (1 unrouted)
CHARLIE13  (1 unrouted)
CHARLIE14  (1 unrouted)
CHARLIE15  (1 unrouted)
CHARLIE16  (1 unrouted)
COL0  (2 unrouted)
COL1  (14 unrouted)
COL2  (14 unrouted)
COL3  (14 unrouted)
COL4  (14 unrouted)
COL5  (14 unrouted)
COL6  (14 unrouted)
COL7  (14 unrouted)
COL8  (16 unrouted)
COL9  (16 unrouted)
COL10  (16 unrouted)
COL11  (16 unrouted)
COL12  (16 unrouted)
COL13  (16 unrouted)
COL14  (16 unrouted)
COL15  (16 unrouted)
COL16  (4 unrouted)
GND  (18 unrouted)
LIGHT_SENSOR  (2 unrouted)
N$1  (1 unrouted)
N$2  (2 unrouted)
N$3  (2 unrouted)
N$4  (1 unrouted)
N$5  (2 unrouted)
N$9  (1 unrouted)
POWER_SENSE  (2 unrouted)
ROW0  (32 unrouted)
ROW1  (28 unrouted)
ROW2  (28 unrouted)
ROW3  (28 unrouted)
ROW4  (28 unrouted)
ROW5  (28 unrouted)
ROW6  (28 unrouted)
ROW7  (32 unrouted)
VDD  (15 unrouted)